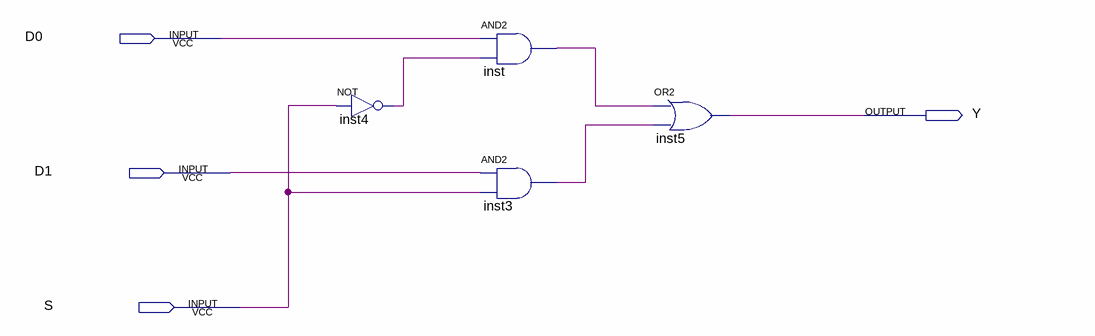
[diagram p0: schematic sheet]
// Quartus schematic MUX21.bdf as structural Verilog: 4 symbols, 4 pins
module MUX21 (
  input  D0,
  input  D1,
  input  S,
  output Y
);

  wire inst3_out, inst4_out, inst_out;

  not inst4 (inst4_out, S);
  and inst (inst_out, D0, inst4_out);
  and inst3 (inst3_out, D1, S);
  or inst5 (Y, inst_out, inst3_out);
endmodule
